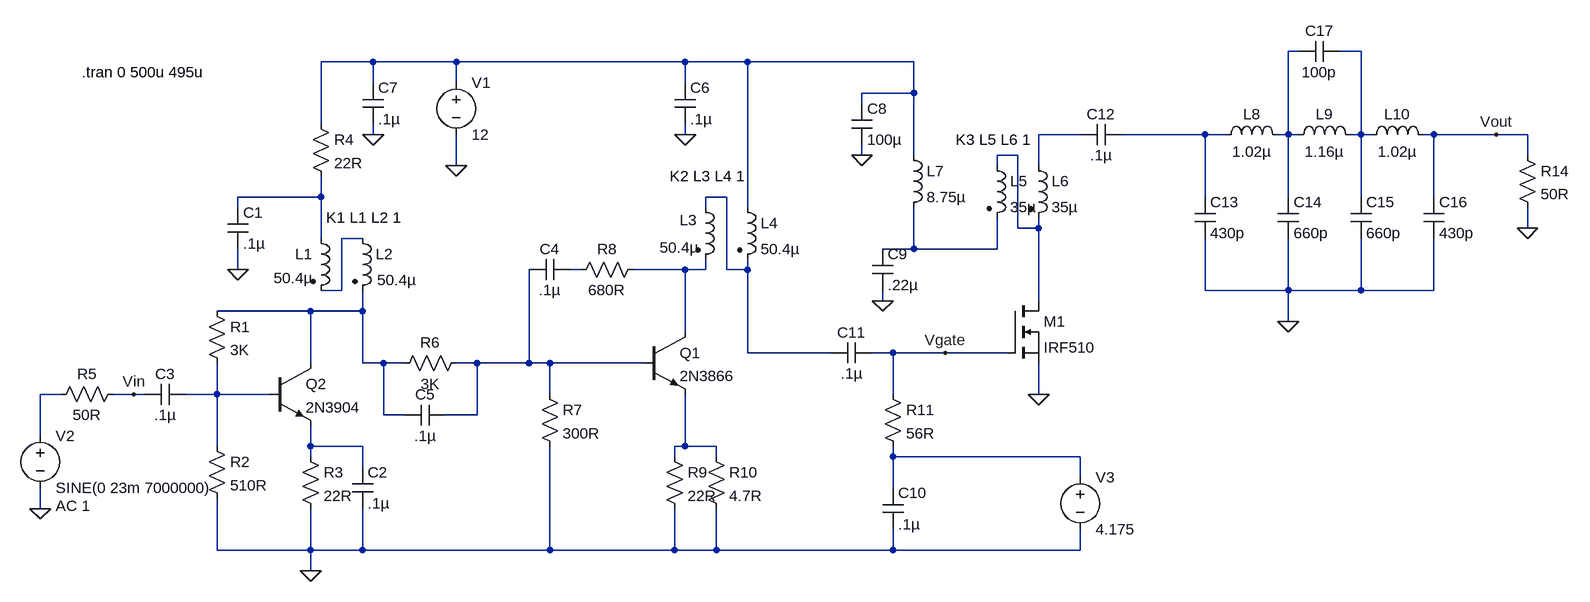
[diagram p0: schematic Power Amp Testing.asc]
Power Amp Testing.asc, the LTspice schematic file:
Version 4
SHEET 1 1768 680
WIRE 1344 -304 1328 -304
WIRE 1440 -304 1408 -304
WIRE -80 -288 -160 -288
WIRE 48 -288 -80 -288
WIRE 400 -288 48 -288
WIRE 496 -288 400 -288
WIRE 752 -288 496 -288
WIRE -80 -256 -80 -288
WIRE 48 -256 48 -288
WIRE 400 -256 400 -288
WIRE 752 -240 752 -288
WIRE 752 -240 672 -240
WIRE 672 -224 672 -240
WIRE -160 -192 -160 -288
WIRE -80 -176 -80 -192
WIRE 400 -176 400 -192
WIRE 1008 -176 944 -176
WIRE 1200 -176 1072 -176
WIRE 1232 -176 1200 -176
WIRE 1328 -176 1328 -304
WIRE 1328 -176 1312 -176
WIRE 1344 -176 1328 -176
WIRE 1440 -176 1440 -304
WIRE 1440 -176 1424 -176
WIRE 1456 -176 1440 -176
WIRE 1552 -176 1536 -176
WIRE 1648 -176 1552 -176
WIRE 1696 -176 1648 -176
WIRE 672 -144 672 -160
WIRE 752 -144 752 -240
WIRE 912 -144 880 -144
WIRE 1696 -144 1696 -176
WIRE 48 -128 48 -176
WIRE 880 -128 880 -144
WIRE 944 -128 944 -176
WIRE -160 -80 -160 -112
WIRE -160 -80 -288 -80
WIRE 464 -80 432 -80
WIRE 1200 -80 1200 -176
WIRE 1328 -80 1328 -176
WIRE 1440 -80 1440 -176
WIRE 1552 -80 1552 -176
WIRE -288 -64 -288 -80
WIRE 432 -64 432 -80
WIRE 496 -64 496 -288
WIRE 912 -32 912 -144
WIRE 944 -32 944 -48
WIRE 944 -32 912 -32
WIRE 1696 -32 1696 -64
WIRE -160 -16 -160 -80
WIRE -96 -16 -128 -16
WIRE 752 0 752 -64
WIRE 752 0 704 0
WIRE 880 0 880 -48
WIRE 880 0 752 0
WIRE -288 32 -288 0
WIRE 240 32 224 32
WIRE 400 32 320 32
WIRE 432 32 432 16
WIRE 432 32 400 32
WIRE 464 32 464 -80
WIRE 496 32 496 16
WIRE 496 32 464 32
WIRE -128 64 -128 -16
WIRE -128 64 -160 64
WIRE 1200 64 1200 -16
WIRE 1328 64 1328 -16
WIRE 1328 64 1200 64
WIRE 1440 64 1440 -16
WIRE 1440 64 1328 64
WIRE 1552 64 1552 -16
WIRE 1552 64 1440 64
WIRE 704 80 704 64
WIRE 944 80 944 -32
WIRE -176 96 -320 96
WIRE -96 96 -96 64
WIRE -96 96 -176 96
WIRE 1328 112 1328 64
WIRE 400 128 400 32
WIRE 496 160 496 32
WIRE 624 160 496 160
WIRE 720 160 688 160
WIRE 800 160 720 160
WIRE 896 160 800 160
WIRE -176 176 -176 96
WIRE -96 176 -96 96
WIRE -64 176 -96 176
WIRE -32 176 -64 176
WIRE 80 176 48 176
WIRE 160 176 160 32
WIRE 160 176 80 176
WIRE 192 176 160 176
WIRE 336 176 192 176
WIRE -560 224 -592 224
WIRE -448 224 -480 224
WIRE -432 224 -448 224
WIRE -320 224 -320 176
WIRE -320 224 -368 224
WIRE -240 224 -320 224
WIRE 192 224 192 176
WIRE 720 224 720 160
WIRE 944 224 944 176
WIRE -64 256 -64 176
WIRE -32 256 -64 256
WIRE 80 256 80 176
WIRE 80 256 32 256
WIRE -592 288 -592 224
WIRE -320 304 -320 224
WIRE -176 304 -176 272
WIRE -96 304 -176 304
WIRE 400 304 400 224
WIRE 400 304 384 304
WIRE 448 304 400 304
WIRE -176 320 -176 304
WIRE 384 320 384 304
WIRE 448 320 448 304
WIRE 720 320 720 304
WIRE 1008 320 720 320
WIRE -96 336 -96 304
WIRE 1008 352 1008 320
WIRE 720 368 720 320
WIRE -592 400 -592 368
WIRE -320 464 -320 384
WIRE -176 464 -176 400
WIRE -176 464 -320 464
WIRE -96 464 -96 400
WIRE -96 464 -176 464
WIRE 192 464 192 304
WIRE 192 464 -96 464
WIRE 384 464 384 400
WIRE 384 464 192 464
WIRE 448 464 448 400
WIRE 448 464 384 464
WIRE 720 464 720 432
WIRE 720 464 448 464
WIRE 1008 464 1008 432
WIRE 1008 464 720 464
WIRE -176 496 -176 464
FLAG -176 496 0
FLAG -288 32 0
FLAG 48 -128 0
FLAG -592 400 0
FLAG 400 -176 0
FLAG -80 -176 0
FLAG 672 -144 0
FLAG 704 80 0
FLAG 1696 -32 0
FLAG 944 224 0
FLAG 1648 -176 Vout
FLAG -448 224 Vin
FLAG 800 160 Vgate
FLAG 1328 112 0
SYMBOL npn 336 128 R0
SYMATTR InstName Q1
SYMATTR Value 2N3866
SYMBOL npn -240 176 R0
SYMATTR InstName Q2
SYMATTR Value 2N3904
SYMBOL nmos 896 80 R0
SYMATTR InstName M1
SYMATTR Value IRF510
SYMBOL res -336 80 R0
SYMATTR InstName R1
SYMATTR Value 3K
SYMBOL res -336 288 R0
SYMATTR InstName R2
SYMATTR Value 510R
SYMBOL res -192 304 R0
SYMATTR InstName R3
SYMATTR Value 22R
SYMBOL res -176 -208 R0
SYMATTR InstName R4
SYMATTR Value 22R
SYMBOL ind2 -176 -32 R0
WINDOW 0 -24 40 Left 2
WINDOW 3 -57 77 Left 2
SYMATTR InstName L1
SYMATTR Value 50.4µ
SYMATTR Type ind
SYMBOL ind2 -112 -32 R0
WINDOW 3 38 80 Left 2
SYMATTR Value 50.4µ
SYMATTR InstName L2
SYMATTR Type ind
SYMBOL cap -304 -64 R0
SYMATTR InstName C1
SYMATTR Value .1µ
SYMBOL cap -112 336 R0
SYMATTR InstName C2
SYMATTR Value .1µ
SYMBOL cap -368 208 R90
WINDOW 0 0 32 VBottom 2
WINDOW 3 32 32 VTop 2
SYMATTR InstName C3
SYMATTR Value .1µ
SYMBOL voltage 48 -272 R0
WINDOW 123 0 0 Left 2
WINDOW 39 0 0 Left 2
SYMATTR InstName V1
SYMATTR Value 12
SYMBOL voltage -592 272 R0
WINDOW 123 24 124 Left 2
WINDOW 39 0 0 Left 2
SYMATTR Value2 AC 1
SYMATTR InstName V2
SYMATTR Value SINE(0 23m 7000000)
SYMBOL res -464 208 R90
WINDOW 0 0 56 VBottom 2
WINDOW 3 32 56 VTop 2
SYMATTR InstName R5
SYMATTR Value 50R
SYMBOL res 64 160 R90
WINDOW 0 0 56 VBottom 2
WINDOW 3 32 56 VTop 2
SYMATTR InstName R6
SYMATTR Value 3K
SYMBOL res 176 208 R0
SYMATTR InstName R7
SYMATTR Value 300R
SYMBOL res 336 16 R90
WINDOW 0 0 56 VBottom 2
WINDOW 3 32 56 VTop 2
SYMATTR InstName R8
SYMATTR Value 680R
SYMBOL cap 224 16 R90
WINDOW 0 0 32 VBottom 2
WINDOW 3 32 32 VTop 2
SYMATTR InstName C4
SYMATTR Value .1µ
SYMBOL cap -32 272 R270
WINDOW 0 32 32 VTop 2
WINDOW 3 0 32 VBottom 2
SYMATTR InstName C5
SYMATTR Value .1µ
SYMBOL ind2 416 -80 R0
WINDOW 0 -24 36 Left 2
WINDOW 3 -55 78 Left 2
SYMATTR InstName L3
SYMATTR Value 50.4µ
SYMATTR Type ind
SYMBOL ind2 480 -80 R0
SYMATTR InstName L4
SYMATTR Value 50.4µ
SYMATTR Type ind
SYMBOL res 368 304 R0
SYMATTR InstName R9
SYMATTR Value 22R
SYMBOL res 432 304 R0
SYMATTR InstName R10
SYMATTR Value 4.7R
SYMBOL cap 384 -256 R0
SYMATTR InstName C6
SYMATTR Value .1µ
SYMBOL cap -96 -256 R0
SYMATTR InstName C7
SYMATTR Value .1µ
SYMBOL ind2 864 -144 R0
SYMATTR InstName L5
SYMATTR Value 35µ
SYMATTR Type ind
SYMBOL ind2 928 -144 R0
SYMATTR InstName L6
SYMATTR Value 35µ
SYMATTR Type ind
SYMBOL ind 736 -160 R0
SYMATTR InstName L7
SYMATTR Value 8.75µ
SYMBOL cap 656 -224 R0
SYMATTR InstName C8
SYMATTR Value 100µ
SYMBOL cap 688 0 R0
SYMATTR InstName C9
SYMATTR Value .22µ
SYMBOL res 704 208 R0
SYMATTR InstName R11
SYMATTR Value 56R
SYMBOL cap 704 368 R0
SYMATTR InstName C10
SYMATTR Value .1µ
SYMBOL voltage 1008 336 R0
WINDOW 123 0 0 Left 2
WINDOW 39 0 0 Left 2
SYMATTR InstName V3
SYMATTR Value 4.175
SYMBOL cap 688 144 R90
WINDOW 0 0 32 VBottom 2
WINDOW 3 32 32 VTop 2
SYMATTR InstName C11
SYMATTR Value .1µ
SYMBOL cap 1072 -192 R90
WINDOW 0 0 32 VBottom 2
WINDOW 3 32 32 VTop 2
SYMATTR InstName C12
SYMATTR Value .1µ
SYMBOL res 1680 -160 R0
SYMATTR InstName R14
SYMATTR Value 50R
SYMBOL ind 1216 -160 R270
WINDOW 0 32 56 VTop 2
WINDOW 3 5 56 VBottom 2
SYMATTR InstName L8
SYMATTR Value 1.02µ
SYMBOL ind 1328 -160 R270
WINDOW 0 32 56 VTop 2
WINDOW 3 5 56 VBottom 2
SYMATTR InstName L9
SYMATTR Value 1.16µ
SYMBOL ind 1440 -160 R270
WINDOW 0 32 56 VTop 2
WINDOW 3 5 56 VBottom 2
SYMATTR InstName L10
SYMATTR Value 1.02µ
SYMBOL cap 1184 -80 R0
SYMATTR InstName C13
SYMATTR Value 430p
SYMBOL cap 1312 -80 R0
SYMATTR InstName C14
SYMATTR Value 660p
SYMBOL cap 1424 -80 R0
SYMATTR InstName C15
SYMATTR Value 660p
SYMBOL cap 1536 -80 R0
SYMATTR InstName C16
SYMATTR Value 430p
SYMBOL cap 1408 -320 R90
WINDOW 0 0 32 VBottom 2
WINDOW 3 32 32 VTop 2
SYMATTR InstName C17
SYMATTR Value 100p
TEXT -152 -48 Left 2 !K1 L1 L2 1
TEXT 376 -112 Left 2 !K2 L3 L4 1
TEXT 816 -168 Left 2 !K3 L5 L6 1
TEXT -528 -272 Left 2 !.tran 0 500u 495u

The netlist it stands for:
* Power Amp Testing.asc
Q1 N012 N014 N018 0 2N3866
Q2 N013 N016 N017 0 2N3904
M1 N006 Vgate 0 0 IRF510
R1 N013 N016 3K
R2 N016 0 510R
R3 N017 0 22R
R4 N003 N007 22R
L1 N007 N009 50.4µ
L2 N009 N013 50.4µ
C1 N007 0 .1µ
C2 N017 0 .1µ
C3 N016 Vin .1µ
V1 N003 0 12
V2 N015 0 SINE(0 23m 7000000) AC 1
R5 Vin N015 50R
R6 N014 N013 3K
R7 N014 0 300R
R8 N012 N011 680R
C4 N011 N014 .1µ
C5 N013 N014 .1µ
L3 N008 N012 50.4µ
L4 N003 N008 50.4µ
R9 N018 0 22R
R10 N018 0 4.7R
C6 N003 0 .1µ
C7 N003 0 .1µ
L5 N006 N010 35µ
L6 N004 N006 35µ
L7 N003 N010 8.75µ
C8 N003 0 100µ
C9 N010 0 .22µ
R11 Vgate N019 56R
C10 N019 0 .1µ
V3 N019 0 4.175
C11 Vgate N008 .1µ
C12 N005 N004 .1µ
R14 Vout 0 50R
L8 N005 N001 1.02µ
L9 N001 N002 1.16µ
L10 N002 Vout 1.02µ
C13 N005 0 430p
C14 N001 0 660p
C15 N002 0 660p
C16 Vout 0 430p
C17 N002 N001 100p
.model NPN NPN
.model PNP PNP
.lib standard.bjt
.model NMOS NMOS
.model PMOS PMOS
.lib standard.mos
K1 L1 L2 1
K2 L3 L4 1
K3 L5 L6 1
.tran 0 500u 495u
.backanno
.end